# Altium project Center Console.PrjPcb (part 2 of 2)

## Sheet Center Console - Raspberry Pi Interface.SchDoc: Center Console - Raspberry Pi Interface
size B; Organization: Midnight Sun Solar Rayce Car Team; Address1: University of Waterloo; Address2: 200 University Ave W; Address3: Waterloo, ON, Canada; Address4: N2L 3E9; DocumentNumber: 4; SheetNumber: 4; SheetTotal: 4; Website: www.uwmidsun.com; ProjectName: ProjectName
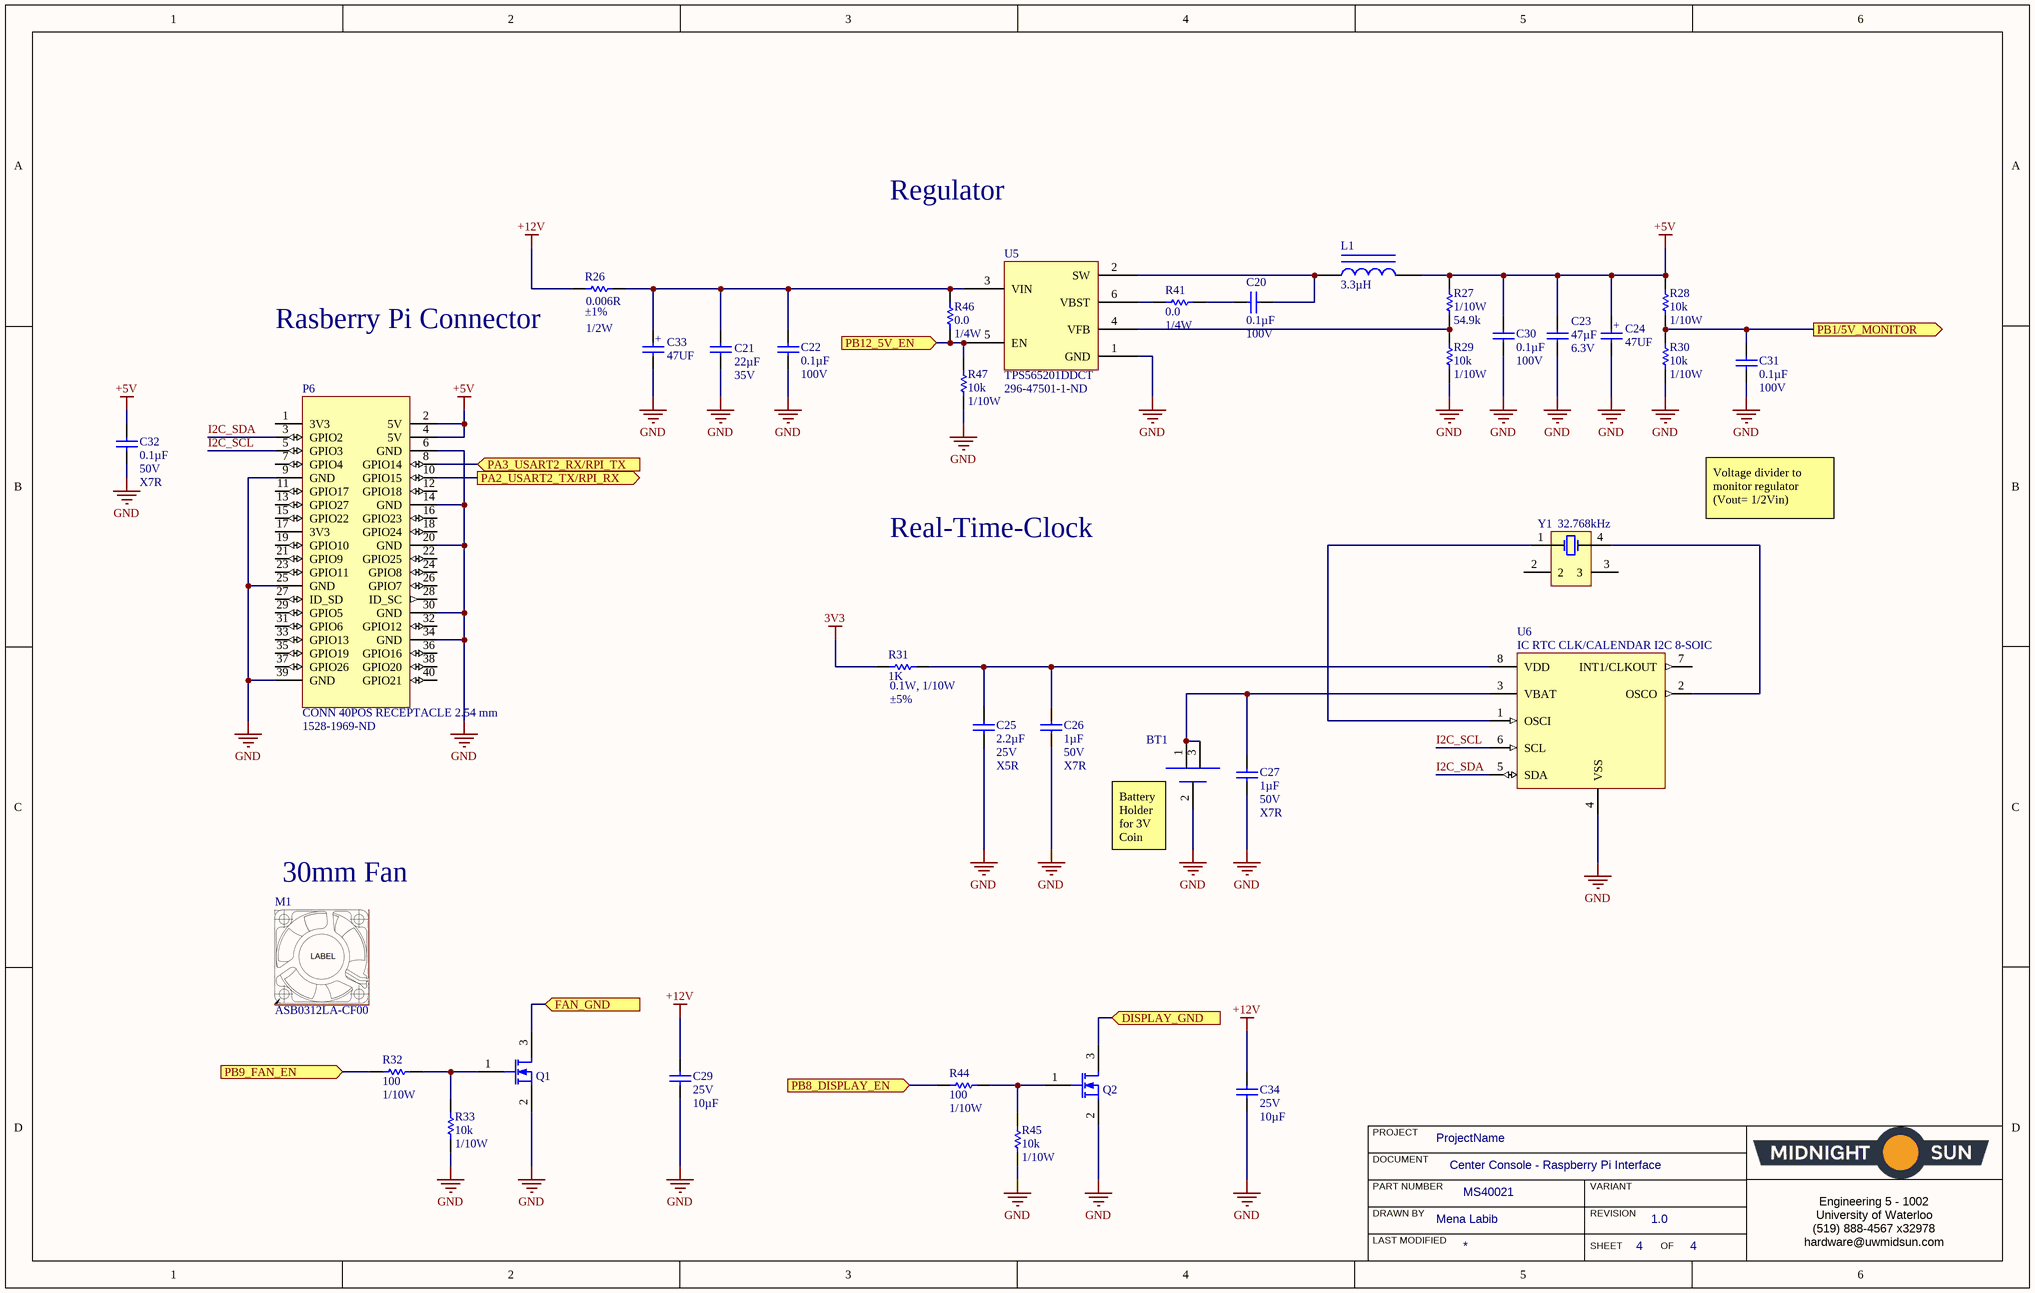
[diagram p3: Center Console - Raspberry Pi Interface.SchDoc]

### Parts
BT1  HOLDER BATTERY COIN 12MM DIA  [HOLDER COIN CELL 1220 3V]  (value not drawn)
C20  Capacitance: 0.1µF  Voltage: 100V  [CAP, 0805]  (hidden comment: CAP CER 0.1UF 100V 10% X7R 0805)
C21  CAP CER 22UF 35V X5R 0805  [CAP, 0805]  (value not drawn)
C22  Capacitance: 0.1µF  Voltage: 100V  [CAP, 0805]  (hidden comment: CAP CER 0.1UF 100V 10% X7R 0805)
C23  CAP CER 47UF 6.3V X7R 1210  [1210]  (value not drawn)
C24  47UF  [CAP ALUM 6.3MM RADIAL SMD]
C25  Capacitance: 2.2µF  Voltage: 25V  Temperature Coefficient: X5R  [CAP, 0603]  (hidden comment: CAP CER 2.2UF 25V 10% X5R 0603)
C26  Capacitance: 1µF  Voltage: 50V  Temperature Coefficient: X7R  [CAP, 0603]  (hidden comment: CAP CER 1UF 50V 10% X7R 0603)
C27  Capacitance: 1µF  Voltage: 50V  Temperature Coefficient: X7R  [CAP, 0603]  (hidden comment: CAP CER 1UF 50V 10% X7R 0603)
C29  Voltage - Rated: 25V  Capacitance: 10µF  [CAP, 0805]  (hidden comment: CAP CER 10uF 25V 10% X5R 0805)
C30  Capacitance: 0.1µF  Voltage: 100V  [CAP, 0805]  (hidden comment: CAP CER 0.1UF 100V 10% X7R 0805)
C31  Capacitance: 0.1µF  Voltage: 100V  [CAP, 0805]  (hidden comment: CAP CER 0.1UF 100V 10% X7R 0805)
C32  Capacitance: 0.1µF  Voltage: 50V  Temperature Coefficient: X7R  [CAP, 0603]  (hidden comment: CAP CER 0.1UF 50V 10% X7R 0603)
C33  47UF  [CAP ALUM 6.3MM RADIAL SMD]
C34  Voltage - Rated: 25V  Capacitance: 10µF  [CAP, 0805]  (hidden comment: CAP CER 10uF 25V 10% X5R 0805)
L1  Inductance: 3.3µH  [IND 3.3UH 5.2A 20 MOHM SMD VLP8040]  (hidden comment: IND 3.3uH 5.2A 20MOHM SMD)
M1  Manufacturer Part Number: ASB0312LA-CF00  [FAN AXIAL 30x10MM 12VDC]  (hidden comment: FAN AXIAL 30x10MM 12VDC)
P6  CONN 40POS RECEPTACLE 2.54 mm  Supplier Part Number 1: 1528-1969-ND  [CONN 40POS RECEPTACLE 2.54 MM]
Q1  MOSFET N-CH 30V 6.2A 0.9W SOT-23  [MOSFET N-CH 30V 6.2A 0.9W SOT-23]  (value not drawn)
Q2  MOSFET N-CH 30V 6.2A 0.9W SOT-23  [MOSFET N-CH 30V 6.2A 0.9W SOT-23]  (value not drawn)
R26  Tolerance: ±1%  Resistance (Ohms): 0.006R  Power (Watts): 1/2W  [RES 1206]  (hidden comment: RES 0.006 OHM 1% 1/2W 1206)
R27  Power (Watts): 1/10W  Resistance (Ohms): 54.9k  [RES, 0603]  (hidden comment: RES 54.9K OHM 1% 1/10W 0603)
R28  Resistance: 10k  Power: 1/10W  [RES, 0603]  (hidden comment: RES 10K OHM 1% 1/10W 0603)
R29  Resistance: 10k  Power: 1/10W  [RES, 0603]  (hidden comment: RES 10K OHM 1% 1/10W 0603)
R30  Resistance: 10k  Power: 1/10W  [RES, 0603]  (hidden comment: RES 10K OHM 1% 1/10W 0603)
R31  1K  Tolerance: ±5%  Power (Watts): 0.1W, 1/10W  [RES, 0603]
R32  Resistance: 100  Power: 1/10W  [RES, 0603]  (hidden comment: RES 100 OHM 1% 1/10W 0603)
R33  Resistance: 10k  Power: 1/10W  [RES, 0603]  (hidden comment: RES 10K OHM 1% 1/10W 0603)
R41  Resistance: 0.0  Power (Watts): 1/4W  [RES, 0603]  (hidden comment: RES 0.0 OHM 1/4W 0603)
R44  Resistance: 100  Power: 1/10W  [RES, 0603]  (hidden comment: RES 100 OHM 1% 1/10W 0603)
R45  Resistance: 10k  Power: 1/10W  [RES, 0603]  (hidden comment: RES 10K OHM 1% 1/10W 0603)
R46  Resistance: 0.0  Power (Watts): 1/4W  [RES, 0603]  (hidden comment: RES 0.0 OHM 1/4W 0603)
R47  Resistance: 10k  Power: 1/10W  [RES, 0603]  (hidden comment: RES 10K OHM 1% 1/10W 0603)
U5  Manufacturer Part Number: TPS565201DDCT  Supplier Part Number 1: 296-47501-1-ND  [IC REG BUCK 4.5V TO 17V, 5A]  (hidden comment: IC REG BUCK 4.5V TO 17V, 5A, SYNCHRONOUS STE)
U6  IC RTC CLK/CALENDAR I2C 8-SOIC  [SOIC8]
Y1  Frequency: 32.768kHz  [4-SOJ]  (hidden comment: CRYSTAL 32.7680KHZ 12.5PF SMD)

### Ports
DISPLAY_GND (in), FAN_GND (in), PA2_USART2_TX/RPI_RX (out), PA3_USART2_RX/RPI_TX (in), PB1/5V_MONITOR (out), PB8_DISPLAY_EN (in), PB9_FAN_EN (in), PB12_5V_EN (in)

### Nets
3V3: R31.1
+5V: C23.1 C24.1 C30.1 C32.1 L1.2 P6.2(5V) P6.4(5V) R27.1 R28.1
+12V: C29.1 C34.1 R26.1
GND: BT1.2(negative) C21.2 C22.2 C23.2 C24.2 C25.2 C26.2 C27.2 C29.2 C30.2 C31.2 C32.2 C33.2 C34.2 P6.6(GND) P6.9(GND) P6.14(GND) P6.20(GND) P6.25(GND) P6.30(GND) P6.34(GND) P6.39(GND) Q1.2(S) Q2.2(S) R29.2 R30.2 R33.2 R45.2 R47.2 U5.1(GND) U6.4(VSS)
DISPLAY_GND: Q2.3(D) ; port DISPLAY_GND
FAN_GND: Q1.3(D) ; port FAN_GND
I2C_SCL: P6.5(GPIO3) U6.6(SCL)  [project net I2C_SCL_4]
I2C_SDA: P6.3(GPIO2) U6.5(SDA)  [project net I2C_SDA_4]
PA2_RPI_USART2_TX: P6.10(GPIO15) ; port PA2_USART2_TX/RPI_RX
PA3_RPI_USART2_RX: P6.8(GPIO14) ; port PA3_USART2_RX/RPI_TX
PB1/5V_MONITOR: C31.1 R28.2 R30.1 ; port PB1/5V_MONITOR
PB8/DISPLAY_EN: R44.1 ; port PB8_DISPLAY_EN
PB9_FAN_EN: R32.1 ; port PB9_FAN_EN
PB12_5V_EN: R46.2 R47.1 U5.5(EN) ; port PB12_5V_EN
NetBT1_1: BT1.1(positive_1) BT1.3(positive_2) C27.1 U6.3(VBAT)
NetC20_1: C20.1 R41.2
NetC20_2: C20.2 L1.1 U5.2(SW)
NetC21_1: C21.1 C22.1 C33.1 R26.2 R46.1 U5.3(VIN)
NetC25_1: C25.1 C26.1 R31.2 U6.8(VDD)
NetQ1_1: Q1.1(G) R32.2 R33.1
NetQ2_1: Q2.1(G) R44.2 R45.1
NetR27_2: R27.2 R29.1 U5.4(VFB)
NetR41_1: R41.1 U5.6(VBST)
NetU6_1: U6.1(OSCI) Y1.1
NetU6_2: U6.2(OSCO) Y1.4

Not connected (* = marked no-connect by the designer): P6 1(3V3) 7(GPIO4) 11(GPIO17) 12(GPIO18) 13(GPIO27) 15(GPIO22) 16(GPIO23) 17(3V3) 18(GPIO24) 19(GPIO10) 21(GPIO9) 22(GPIO25) 23(GPIO11) 24(GPIO8) 26(GPIO7) 27(ID_SD) 28(ID_SC) 29(GPIO5) 31(GPIO6) 32(GPIO12) 33(GPIO13) 35(GPIO19) 36(GPIO16) 37(GPIO26) 38(GPIO20) 40(GPIO21); U6 7(INT1/CLKOUT); Y1 2 3

### Notes on the sheet
- Regulator
- (near R26) Rasberry Pi Connector
- Real-Time-Clock
- Voltage divider to monitor regulator (Vout= 1/2Vin)
- (near M1) 30mm Fan
- (near BT1) Battery Holder for 3V Coin Cell
- PROJECT
- DOCUMENT
- DRAWN BY
- LAST MODIFIED
- PART NUMBER
- REVISION
- SHEET
- VARIANT
- OF
- Engineering 5 - 1002
  University of Waterloo
  (519) 888-4567 x32978
  hardware@uwmidsun.com
- (in symbol CAP ALUM 47UF 20% 35V SMD) +
- (in symbol CAP CER 22UF 35V X5R 0805) 22µF
- (in symbol CAP CER 47UF 6.3V X7R 1210) 47µF

### Library data of the parts
BT1 = HOLDER BATTERY COIN 12MM DIA: Coin cell holder smd; Manufacturer: Keystone Electronics; Manufacturer Part Number: 3000; Body Material: Bronze; Number of Batteries: 1; Supplier 1: Digi-Key; Stock 1: 17093; Pricing 1: 1=0.58, 10=0.545, 50=0.4356, 100=0.4175, 250=0.38116, 500=0.363, 1000=0.30495, 2500=0.27225, 5000=0.26318 (USD); Mount: Surface Mount,PCB; Contact Material: Bronze,Nickel; Material: Bronze; Contact Plating: Nickel; Package Quantity: 100; Packaging: Bulk; Termination: SMD/SMT; Number of Cells: 1; Diameter: 12mm; Height: 3.17mm; REACH SVHC: No SVHC; Lead Free: Lead Free; ComponentLink1URL: https://datasheet.ciiva.com/3/3000-3953.pdf; ComponentLink1Description: https://datasheet.ciiva.com/3/3000-3953.pdf; ComponentLink2URL: https://datasheet.ciiva.com/11714/0900766b8002ef78-11714721.pdf; ComponentLink2Description: https://datasheet.ciiva.com/11714/0900766b8002ef78-11714721.pdf; ComponentLink3URL: https://datasheet.ciiva.com/20221/18-3570e-20221596.pdf; ComponentLink3Description: https://datasheet.ciiva.com/20221/18-3570e-20221596.pdf; ComponentLink4URL: https://datasheet.ciiva.com/1391/1718262-1391630.pdf; ComponentLink4Description: https://datasheet.ciiva.com/1391/1718262-1391630.pdf; Supplier Part Number 1: 36-3000-ND
C20 C22 C30 C31 = CAP CER 0.1UF 100V 10% X7R 0805: 0.1µF ±10% 100V Ceramic Capacitor X7R 0805 (2012 Metric); Manufacturer 1: Murata Electronics North America; Manufacturer Part Number 1: GCM21BR72A104KA37L; Supplier 1: Digi-Key; Supplier Part Number 1: 490-4789-1-ND; Packaging: Cut Tape (CT); Part Status: Active; Operating Temperature: -55°C ~ 125°C; Ratings: AEC-Q200; Mounting Type: Surface Mount, MLCC; Package / Case: 0805 (2012 Metric); Size / Dimension: 0.079" L x 0.049" W (2.00mm x 1.25mm); Height - Seated (Max): -; Thickness (Max): 0.055" (1.40mm); Lead Spacing: -; Lead Style: -; ComponentLink1URL: http://www.murata.com/~/media/webrenewal/support/library/catalog/products/capacitor/mlcc/c03e.ashx; ComponentLink1Description: http://www.murata.com/~/media/webrenewal/support/library/catalog/products/capacitor/mlcc/c03e.ashx; Tolerance: ±10%; Temperature Coefficient: X7R
C21 = CAP CER 22UF 35V X5R 0805: 22µF ±20% 35V Ceramic Capacitor X5R 0805 (2012 Metric); Manufacturer: TDK; Manufacturer Part Number: C2012X5R1V226M125AC; Supplier 1: Digi-Key; RoHS: Yes; Stock 1: 30; Pricing 1: 1 = 1.29000, 10 = 0.98100, 100 = 0.70190, 500 = 0.54338, 1000 = 0.46791 (USD); Mount: Surface Mount; Case/Package: 0805; Weight: 0.000194oz; Case Code (Metric): 2012; Case Code (Imperial): 0805; Dielectric Material: Ceramic; Min Operating Temperature: -55°C; Max Operating Temperature: 85°C; Package Quantity: 2000; Packaging: Tape and Reel; Capacitance: 22uF; Tolerance: 20%; Voltage Rating: 35V; Dielectric: X5R; Termination: SMD/SMT; Voltage Rating (DC): 35V; Length: 0.079inch; Height: 1.25mm; Width: 0.049inch; Thickness: 0.057inch; REACH SVHC: No SVHC; Lead Free: Lead Free; ComponentLink1URL: https://product.tdk.com/info/en/catalog/spec/mlccspec_commercial_general_midvoltage_en.pdf; ComponentLink1Description: https://product.tdk.com/info/en/catalog/spec/mlccspec_commercial_general_midvoltage_en.pdf; Supplier Part Number 1: 445-14428-1-ND
C23 = CAP CER 47UF 6.3V X7R 1210: 47µF ±10% 6.3V Ceramic Capacitor X7R 1210 (3225 Metric); Manufacturer: Murata; Manufacturer Part Number: GCJ32ER70J476KE01L; Supplier 1: Digi-Key; RoHS: Yes; Stock 1: 191399; Pricing 1: 1 = 1.53000, 10 = 1.21200, 100 = 0.90890, 500 = 0.68670 (USD); Mount: Surface Mount; Case/Package: 1210; Weight: 0.00388oz; Case Code (Metric): 3225; Case Code (Imperial): 1210; Min Operating Temperature: -55°C; Max Operating Temperature: 125°C; Capacitance: 47uF; Packaging: Tape and Reel; Voltage Rating: 6.3V; Tolerance: 10%; Dielectric: X7R; Termination: SMD/SMT; Voltage Rating (DC): 6.3V; Package Quantity: 1000; Features: Soft Termination; Length: 0.126inch; Height: 2.5mm; Width: 0.098inch; Thickness: 0.11inch; Ratings: AEC-Q200; Lead Free: Lead Free; Supplier Part Number 1: 490-10559-1-ND
C24 C33 = CAP ALUM 47UF 20% 35V SMD: 47µF 35V Aluminum Electrolytic Capacitors Radial, Can - SMD 1000 Hrs @ 85°C; Manufacturer: Panasonic; Manufacturer Part Number: EEE-1VA470WP; Tolerance: 20%; Ripple Current: 70mA; Life (Hours): 1000Hour; Supplier 1: Digi-Key; Stock 1: 2820; Pricing 1: 1=0.38, 10=0.263, 100=0.1579, 500=0.11846 (USD); Mount: Surface Mount,PCB; Case/Package: Radial; Contact Plating: Tin; Min Operating Temperature: -40°C; Max Operating Temperature: 85°C; Capacitance: 47uF; Voltage Rating (DC): 35V; Voltage Rating: 35V; Packaging: Tape and Reel; Package Quantity: 1; Ripple Current (AC): 70mA; Termination: SMD/SMT; Diameter: 6.3mm; Length: 5.5mm; Height: 5.4mm; Height - Seated (Max): 0.213inch; Radiation Hardening: No; REACH SVHC: Unknown; Lead Free: Lead Free; ComponentLink1URL: https://datasheet.ciiva.com/2983/aba0000ce2-2983926.pdf; ComponentLink1Description: https://datasheet.ciiva.com/2983/aba0000ce2-2983926.pdf; ComponentLink2URL: https://datasheet.ciiva.com/2983/aba0000ce2-2983927.pdf; ComponentLink2Description: https://datasheet.ciiva.com/2983/aba0000ce2-2983927.pdf; ComponentLink3URL: https://datasheet.ciiva.com/14598/70255710-14598937.pdf; ComponentLink3Description: https://datasheet.ciiva.com/14598/70255710-14598937.pdf; ComponentLink4URL: https://datasheet.ciiva.com/15165/getdatasheetpartid-86239-15165868.pdf; ComponentLink4Description: https://datasheet.ciiva.com/15165/getdatasheetpartid-86239-15165868.pdf; ComponentLink5URL: https://datasheet.ciiva.com/16507/aba0000ce2-16507965.pdf; ComponentLink5Description: https://datasheet.ciiva.com/16507/aba0000ce2-16507965.pdf; ComponentLink6URL: https://datasheet.ciiva.com/30206/11aba0000ce2-30206253.pdf; ComponentLink6Description: https://datasheet.ciiva.com/30206/11aba0000ce2-30206253.pdf; Supplier Part Number 1: PCE3961CT-ND
C25 = CAP CER 2.2UF 25V 10% X5R 0603: 2.2µF ±10% 25V Ceramic Capacitor X5R 0603 (1608 Metric); Manufacturer 1: Murata Electronics North America; Manufacturer Part Number 1: GRM188R61E225KA12D; Supplier 1: Digi-Key; Supplier Part Number 1: 490-10731-1-ND; Packaging: Cut Tape (CT); Part Status: Active; Operating Temperature: -55°C ~ 85°C; Ratings: -; Mounting Type: Surface Mount, MLCC; Package / Case: 0603 (1608 Metric); Size / Dimension: 0.063" L x 0.031" W (1.60mm x 0.80mm); Height - Seated (Max): -; Thickness (Max): 0.035" (0.90mm); Lead Spacing: -; Lead Style: -; ComponentLink1URL: http://www.murata.com/~/media/webrenewal/support/library/catalog/products/capacitor/mlcc/c02e.ashx; ComponentLink1Description: http://www.murata.com/~/media/webrenewal/support/library/catalog/products/capacitor/mlcc/c02e.ashx; Tolerance: ±10%
C26 C27 = CAP CER 1UF 50V 10% X7R 0603: 1µF ±10% 50V Ceramic Capacitor X7R 0603 (1608 Metric); Manufacturer 1: Taiyo Yuden; Manufacturer Part Number 1: UMK107AB7105KA-T; Supplier 1: Digi-Key; Supplier Part Number 1: 587-3247-1-ND; Packaging: Cut Tape (CT); Part Status: Active; Operating Temperature: -55°C ~ 125°C; Ratings: -; Mounting Type: Surface Mount, MLCC; Package / Case: 0603 (1608 Metric); Size / Dimension: 0.063" L x 0.031" W (1.60mm x 0.80mm); Height - Seated (Max): -; Thickness (Max): 0.037" (0.95mm); Lead Spacing: -; Lead Style: -; ComponentLink1URL: http://www.yuden.co.jp/productdata/catalog/en/mlcc_all_e.pdf; ComponentLink1Description: http://www.yuden.co.jp/productdata/catalog/en/mlcc_all_e.pdf; Tolerance: ±10%
C29 C34 = CAP CER 10uF 25V 10% X5R 0805: 10µF ±10% 25V Ceramic Capacitor X5R 0805 (2012 Metric); Manufacturer: Murata Electronics North America; Manufacturer Part Number: GRM21BR61E106KA73L; Supplier 1: Digi-Key; RoHS: RoHS Compliant; Category: Capacitors; Stock 1: 1695157; Packaging: Cut Tape (CT); Part Status: Active; Tolerance: ±10%; Temperature Coefficient: X5R; Operating Temperature: -55°C ~ 85°C; Features: -; Ratings: -; Applications: General Purpose; Mounting Type: Surface Mount, MLCC; Package / Case: 0805 (2012 Metric); Size / Dimension: 0.079" L x 0.049" W (2.00mm x 1.25mm); Height - Seated (Max): -; Thickness (Max): 0.053" (1.35mm); Lead Spacing: -; Lead Style: -; ComponentLink1URL: http://search.murata.co.jp/Ceramy/image/img/A01X/G101/ENG/GRM21BR61E106KA73-01.pdf; ComponentLink1Description: http://search.murata.co.jp/Ceramy/image/img/A01X/G101/ENG/GRM21BR61E106KA73-01.pdf; Supplier Part Number 1: 490-5523-1-ND; Pricing 1: 1=0.3, 10=0.214, 100=0.1008, 500=0.07068, 1000=0.05851 (CAD)
C32 = CAP CER 0.1UF 50V 10% X7R 0603: 0.10µF ±10% 50V Ceramic Capacitor X7R 0603 (1608 Metric); Manufacturer 1: AVX Corporation; Manufacturer Part Number 1: 06035C104KAT2A; Supplier 1: Digi-Key; Supplier Part Number 1: 478-5052-1-ND; Packaging: Cut Tape (CT); Part Status: Active; Operating Temperature: -55°C ~ 125°C; Ratings: -; Mounting Type: Surface Mount, MLCC; Package / Case: 0603 (1608 Metric); Size / Dimension: 0.063" L x 0.032" W (1.60mm x 0.81mm); Height - Seated (Max): -; Thickness (Max): 0.035" (0.90mm); Lead Spacing: -; Lead Style: -; ComponentLink1URL: http://datasheets.avx.com/X7RDielectric.pdf; ComponentLink1Description: http://datasheets.avx.com/X7RDielectric.pdf; Tolerance: ±10%
L1 = IND 3.3uH 5.2A 20MOHM SMD: 3.3µH Shielded Wirewound Inductor 5.2A 20 mOhm Max Nonstandard; Manufacturer: TDK Corporation; Manufacturer Part Number: VLS201612CX-3R3M; Material - Core: Ferrite; Tolerance: ±20%; Current Rating: 1.37A; Current - Saturation: 1.04A; DC Resistance (DCR): 170 mOhm Max; Frequency - Test: 1MHz; Inductance Tolerance: 30%; Test Frequency: 100kHz; RoHS: RoHS Compliant; Category: Inductors, Coils, Chokes; Packaging: Cut Tape (CT); Type: Wirewound; Shielding: Shielded; Q @ Freq: -; Frequency - Self Resonant: -; Operating Temperature: -40°C ~ 105°C; Mounting Type: Surface Mount; Package / Case: Nonstandard; Size / Dimension: 0.079" L x 0.063" W (2.00mm x 1.60mm); Height - Seated (Max): 0.047" (1.20mm); Supplier Device Package: 2016; ComponentLink1URL: http://product.tdk.com/en/catalog/datasheets/inductor_commercial_power_vls-cx_en.pdf; ComponentLink1Description: http://product.tdk.com/en/catalog/datasheets/inductor_commercial_power_vls-cx_en.pdf; Supplier 1: Digi-Key; Stock 1: 8114; Pricing 1: 1 = 0.60000, 10 = 0.52700, 100 = 0.37660, 500 = 0.31636 (USD); Mount: Surface Mount; Case/Package: Nonstandard; Core Material: Ferrite; Min Operating Temperature: -40°C; Max Operating Temperature: 105°C; Package Quantity: 1; Saturation Current: 5.2A; Max DC Current: 5.2A; Termination: SMD/SMT; Composition: Wirewound; RMS Current (Irms): 5.2A; Military Standard: Not; Length: 0.315inch; Height: 4mm; Width: 8mm; Depth: 8.7mm; REACH SVHC: No SVHC; Lead Free: Lead Free; ComponentLink2URL: http://www.mouser.com/ds/2/400/nductor_commercial_power_vlp8040_en-952627.pdf; ComponentLink2Description: http://www.mouser.com/ds/2/400/nductor_commercial_power_vlp8040_en-952627.pdf; Supplier Part Number 1: 445-6581-1-ND
M1 = FAN AXIAL 30x10MM 12VDC: FAN AXIAL 30X10MM 12VDC WIRE; Manufacturer: Delta Design; Current Rating: 50mA; Airflow: 3.2CFM; Noise: 21dBA; Max Power Dissipation: 600mW; RPM: 8000RPM; Bearing Type: Sleeve; Supplier 1: Digi-Key; Supplier Part Number 1: 603-1728-ND; RoHS: Yes; Stock 1: 2468; Case/Package: Axial; Weight: 0.016lb; Package Quantity: 1440; Termination: 3 Wire Leads; Width: 10mm; ComponentLink1URL: http://www.delta-fan.com/Download/Spec/ASB0312LA-CF00.pdf; ComponentLink1Description: http://www.delta-fan.com/Download/Spec/ASB0312LA-CF00.pdf
P6 = CONN 40POS RECEPTACLE 2.54 mm: GPIO HEADER FOR RASPBERRYPI A+/B; Manufacturer: Adafruit Industries; Manufacturer Part Number: 1992; Supplier 1: Digi-Key; Stock 1: 175; Pricing 1: 1=2.95 (USD); ComponentLink1Description: gpio header raspberry pi; ComponentLink1URL: https://www.digikey.ca/product-detail/en/adafruit-industries-llc/1992/1528-1969-ND/6827092
Q1 Q2 = MOSFET N-CH 30V 6.2A 0.9W SOT-23: N-Channel 30V 6.2A (Ta) 900mW (Ta) Surface Mount SOT-23; Manufacturer: Diodes; Manufacturer Part Number: DMN3023L-7; Rds On Max: 25mR; Input Capacitance: 873pF; Supplier 1: Digi-Key; Stock 1: 38246; Pricing 1: 1=0.47, 10=0.368, 100=0.2529, 500=0.1734, 1000=0.1301 (USD); Mount: Surface Mount; Case/Package: TO-236-3; Min Operating Temperature: -55°C; Max Operating Temperature: 150°C; Packaging: Tape and Reel; Drain to Source Voltage (Vdss): 30V; Continuous Drain Current (ID): 6.2A; Max Power Dissipation: 900mW; ComponentLink1URL: https://www.diodes.com/assets/Datasheets/DMN3023L.pdf; ComponentLink1Description: https://www.diodes.com/assets/Datasheets/DMN3023L.pdf; ComponentLink2URL: http://www.mouser.com/ds/2/115/DMN3023L-959533.pdf; ComponentLink2Description: http://www.mouser.com/ds/2/115/DMN3023L-959533.pdf; Supplier Part Number 1: DMN3023L-7DICT-ND
R26 = RES 0.006 OHM 1% 1/2W 1206: 0.006 Ohm ±1% 0.5W, 1/2W Chip Resistor 1206 (3216 Metric) Automotive AEC-Q200, Current Sense, Moisture Resistant Metal Element; Manufacturer: Panasonic Electronic Components; Manufacturer Part Number: ERJ-MP2KF6M0U; Temperature Coefficient: ±75ppm/°C; Supplier 1: Digi-Key; Supplier Part Number 1: P19333CT-ND; Packaging: Cut Tape (CT); Part Status: Active; Composition: Metal Element; Operating Temperature: -65°C ~ 170°C; Package / Case: 1206 (3216 Metric); Supplier Device Package: 1206; Size / Dimension: 0.125" L x 0.063" W (3.18mm x 1.60mm); Height - Seated (Max): 0.035" (0.89mm); Failure Rate: -; ComponentLink1URL: http://industrial.panasonic.com/cdbs/www-data/pdf/RDN0000/AOA0000C263.pdf; ComponentLink1Description: http://industrial.panasonic.com/cdbs/www-data/pdf/RDN0000/AOA0000C263.pdf; RoHS: RoHS Compliant; Category: Resistors; Features: Automotive AEC-Q200, Current Sense, Moisture Resistant
R27 = RES 54.9K OHM 1% 1/10W 0603: 54.9k Ohm ±1% 0.1W, 1/10W Chip Resistor 0603 (1608 Metric) Automotive AEC-Q200 Thick Film; Manufacturer: Panasonic Electronic Components; Manufacturer Part Number: ERJ-3EKF5492V; Temperature Coefficient: ±100ppm/°C; Supplier 1: Digi-Key; RoHS: RoHS Compliant; Category: Resistors; Stock 1: 74038; Pricing 1: 1=0.16, 10=0.031, 100=0.0127, 1000=0.00567, 2500=0.00492 (CAD); Packaging: Cut Tape (CT); Part Status: Active; Composition: Thick Film; Features: Automotive AEC-Q200; Operating Temperature: -55°C ~ 155°C; Package / Case: 0603 (1608 Metric); Supplier Device Package: 0603; Size / Dimension: 0.063" L x 0.031" W (1.60mm x 0.80mm); Height - Seated (Max): 0.022" (0.55mm); Failure Rate: -; ComponentLink1URL: https://industrial.panasonic.com/cdbs/www-data/pdf/RDA0000/AOA0000C298.pdf; ComponentLink1Description: https://industrial.panasonic.com/cdbs/www-data/pdf/RDA0000/AOA0000C298.pdf; Supplier Part Number 1: P54.9KHCT-ND; Tolerance: ±1%
R28-R30 R33 R45 R47 = RES 10K OHM 1% 1/10W 0603: RES SMD 10K OHM 1% 1/10W 0603; Manufacturer 1: Yageo; Manufacturer Part Number 1: RC0603FR-0710KL; Temperature Coefficient: ±100ppm/°C; Supplier 1: Digi-Key; Supplier Part Number 1: 311-10.0KHRCT-ND; Packaging: Cut Tape (CT); Part Status: Active; Composition: Thick Film; Operating Temperature: -55°C ~ 155°C; Package / Case: 0603 (1608 Metric); Supplier Device Package: 0603; Size / Dimension: 0.063" L x 0.031" W (1.60mm x 0.80mm); Height - Seated (Max): 0.022" (0.55mm); Failure Rate: -; ComponentLink1URL: http://www.yageo.com/documents/recent/PYu-RC_Group_51_RoHS_L_7.pdf; ComponentLink1Description: http://www.yageo.com/documents/recent/PYu-RC_Group_51_RoHS_L_7.pdf; Tolerance: ±1%
R31 = RES 1K OHM 5% 1/10W 0603: 1k Ohm ±5% 0.1W, 1/10W Chip Resistor 0603 (1608 Metric); Manufacturer: Yageo; Manufacturer Part Number: RC0603JR-071KL; Temperature Coefficient: ±100ppm/°C; Supplier 1: Digi-Key; Supplier Part Number 1: 311-1.0KGRCT-ND; RoHS: RoHS Compliant; Category: Resistors; Stock 1: 4415240; Pricing 1: 1=0.15, 10=0.017, 100=0.0071, 1000=0.0032, 2500=0.00278 (CAD); Packaging: Cut Tape (CT); Part Status: Active; Resistance (Ohms): 1k; Composition: Thick Film; Features: Moisture Resistant; Operating Temperature: -55°C ~ 155°C; Package / Case: 0603 (1608 Metric); Supplier Device Package: 0603; Size / Dimension: 0.063" L x 0.031" W (1.60mm x 0.80mm); Height - Seated (Max): 0.022" (0.55mm); Failure Rate: -; ComponentLink1URL: http://www.yageo.com/documents/recent/PYu-RC_Group_51_RoHS_L_7.pdf; ComponentLink1Description: http://www.yageo.com/documents/recent/PYu-RC_Group_51_RoHS_L_7.pdf
R32 R44 = RES 100 OHM 1% 1/10W 0603: 100 Ohm ±1% 0.1W, 1/10W Chip Resistor 0603 (1608 Metric) Moisture Resistant Thick Film; Manufacturer 1: Yageo; Manufacturer Part Number 1: RC0603FR-07100RL; Temperature Coefficient: ±100ppm/°C; Supplier 1: Digi-Key; Supplier Part Number 1: 311-100HRCT-ND; Packaging: Cut Tape (CT); Part Status: Active; Composition: Thick Film; Operating Temperature: -55°C ~ 155°C; Package / Case: 0603 (1608 Metric); Supplier Device Package: 0603; Size / Dimension: 0.063" L x 0.031" W (1.60mm x 0.80mm); Height - Seated (Max): 0.022" (0.55mm); Failure Rate: -; ComponentLink1URL: http://www.yageo.com/documents/recent/PYu-RC_Group_51_RoHS_L_7.pdf; ComponentLink1Description: http://www.yageo.com/documents/recent/PYu-RC_Group_51_RoHS_L_7.pdf; Tolerance: ±1%
R41 R46 = RES 0.0 OHM 1/4W 0603: RES SMD 0.0 OHM JUMPER 1/4W 0603; Manufacturer 1: Vishay Dale; Manufacturer Part Number 1: CRCW06030000Z0EAHP; Supplier 1: Digi-Key; Supplier Part Number 1: 541-0.0SBCT-ND; Packaging: Cut Tape (CT); Part Status: Active; Composition: Thick Film; Operating Temperature: -55°C ~ 155°C; Package / Case: 0603 (1608 Metric); Supplier Device Package: 0603; Size / Dimension: 0.063" L x 0.033" W (1.60mm x 0.85mm); Height - Seated (Max): 0.022" (0.55mm); Failure Rate: -; ComponentLink1URL: http://www.vishay.com/docs/20043/crcwhpe3.pdf; ComponentLink1Description: http://www.vishay.com/docs/20043/crcwhpe3.pdf
U5 = IC REG BUCK 4.5V TO 17V, 5A, SYNCHRONOUS STE: Buck Switching Regulator IC Positive Adjustable 0.6V 1 Output 5A SOT-23-6 Thin, TSOT-23-6; Manufacturer: Texas Instruments; Supplier 1: Digi-Key; Stock 1: 2226; Pricing 1: 1 = 2.46000, 10 = 2.21100, 100 = 1.77710 (USD); Min Operating Temperature: -40°C; Max Operating Temperature: 125°C
U6 = IC RTC CLK/CALENDAR I2C 8-SOIC: Real Time Clock (RTC) IC Clock/Calendar I²C, 2-Wire Serial 8-SOIC (0.154", 3.90mm Width); Manufacturer: NXP Semiconductors; Manufacturer Part Number: PCF8523T/1,118; Min Supply Voltage: 1.2V; Max Supply Voltage: 5.5V; Time Format: HH:MM:SS; Supplier 1: Digi-Key; Stock 1: 18252; Pricing 1: 1=1.3, 10=1.16, 100=0.9045, 500=0.74718, 1000=0.58988 (USD); Mount: Surface Mount; Case/Package: SO; Number of Pins: 8; Contact Plating: Gold; Min Operating Temperature: -40°C; Max Operating Temperature: 85°C; Packaging: Tape and Reel; Interface: I2C; Package Quantity: 2500; Logic Function: Clock; Radiation Hardening: No; REACH SVHC: No SVHC; Lead Free: Lead Free; ComponentLink1URL: https://datasheet.ciiva.com/15152/getdatasheetpartid-445247-15152839.pdf; ComponentLink1Description: https://datasheet.ciiva.com/15152/getdatasheetpartid-445247-15152839.pdf; ComponentLink2URL: https://datasheet.ciiva.com/1238/pcf8523-1238780.pdf; ComponentLink2Description: https://datasheet.ciiva.com/1238/pcf8523-1238780.pdf; ComponentLink3URL: https://datasheet.ciiva.com/1238/pcf8523-1238781.pdf; ComponentLink3Description: https://datasheet.ciiva.com/1238/pcf8523-1238781.pdf; ComponentLink4URL: https://datasheet.ciiva.com/16286/pcf8523-16286477.pdf; ComponentLink4Description: https://datasheet.ciiva.com/16286/pcf8523-16286477.pdf; ComponentLink5URL: https://datasheet.ciiva.com/1238/pcf8523-1238782.pdf; ComponentLink5Description: https://datasheet.ciiva.com/1238/pcf8523-1238782.pdf; Supplier Part Number 1: 568-5306-1-ND
Y1 = CRYSTAL 32.7680KHZ 12.5PF SMD: 32.768kHz ±20ppm Crystal 12.5pF 50 kOhms 4-SOJ, 5.50mm pitch; Manufacturer: ECS International; Manufacturer Part Number: ECS-.327-12.5-17X-TR; ESR (Equivalent Series Resistance): 50kR; Supplier 1: Digi-Key; Stock 1: 67622; Pricing 1: 1=0.56, 10=0.468, 50=0.4208, 100=0.374, 500=0.3553, 1000=0.2992 (USD); Mount: Surface Mount; Min Operating Temperature: -40°C; Max Operating Temperature: 85°C; Package Quantity: 1; Frequency Tolerance: 20ppm; Load Capacitance: 12.5pF; Packaging: Tape and Reel; Tolerance: 20ppm; Termination: SMD/SMT; Length: 0.315inch; Height: 0.098inch; Width: 0.15inch; Lead Free: Lead Free; ComponentLink1URL: https://datasheet.ciiva.com/852/ecx-306x-852775.pdf; ComponentLink1Description: https://datasheet.ciiva.com/852/ecx-306x-852775.pdf; ComponentLink2URL: https://datasheet.ciiva.com/852/ecx-306x-852776.pdf; ComponentLink2Description: https://datasheet.ciiva.com/852/ecx-306x-852776.pdf; ComponentLink3URL: https://datasheet.ciiva.com/852/ecx-306x-852777.pdf; ComponentLink3Description: https://datasheet.ciiva.com/852/ecx-306x-852777.pdf; Supplier Part Number 1: XC1195CT-ND

## Nets that join several sheets
3V3: Center Console - Connectors (14 pins), Center Console - Buttons Interface (*.14 C1.1 C4.1 U2.5), Center Console - LED Interface (5 pins), Center Console - Raspberry Pi Interface (R31.1)
+5V: Center Console - Connectors (R2.1 TP3.TP), Center Console - Raspberry Pi Interface (9 pins)
+12V: Center Console - Connectors (9 pins), Center Console - LED Interface (C17.1 C18.1 U3.9), Center Console - Raspberry Pi Interface (C29.1 C34.1 R26.1)
GND: Center Console - Connectors (28 pins), Center Console - Buttons Interface (25 pins), Center Console - LED Interface (16 pins), Center Console - Raspberry Pi Interface (31 pins)
BPS_LED: Center Console - Connectors (R42.2), Center Console - LED Interface (U3.11)
DISPLAY_GND: Center Console - Connectors (P8.2), Center Console - Raspberry Pi Interface (Q2.3)
DRIVE_BTN: Center Console - Connectors (P3.13 R38.2), Center Console - Buttons Interface (C15.1 R16.1)
DRIVE_LED: Center Console - Connectors (P3.15), Center Console - LED Interface (U3.17)
DRL_BTN: Center Console - Connectors (P2.11 R36.2), Center Console - Buttons Interface (C13.1 R15.1)
DRL_LED: Center Console - Connectors (P2.5), Center Console - LED Interface (U3.14)
FAN_GND: Center Console - Connectors (P1.2), Center Console - Raspberry Pi Interface (Q1.3)
HAZARDS_BTN: Center Console - Connectors (P2.1 R35.2), Center Console - Buttons Interface (C7.1 R11.1)
HAZARDS_LED: Center Console - Connectors (P2.3), Center Console - LED Interface (U3.12)
LOW_BEAM_BTN: Center Console - Connectors (P2.7 R34.2), Center Console - Buttons Interface (C9.1 R12.1)
LOW_BEAM_LED: Center Console - Connectors (P2.9), Center Console - LED Interface (U3.13)
NEUTRAL_BTN: Center Console - Connectors (P3.9 R37.2), Center Console - Buttons Interface (C11.1 R13.1)
NEUTRAL_LED: Center Console - Connectors (P3.11), Center Console - LED Interface (U3.16)
PA0_LOW_BEAM: Center Console - Connectors (P5.25), Center Console - Buttons Interface (*.2 R9.1)
PA1_HAZARDS: Center Console - Connectors (P5.24), Center Console - Buttons Interface (*.4 R8.1)
PA2_RPI_USART2_TX: Center Console - Connectors (P5.23), Center Console - Raspberry Pi Interface (P6.10)
PA3_RPI_USART2_RX: Center Console - Connectors (P5.22), Center Console - Raspberry Pi Interface (P6.8)
PA4_DRL: Center Console - Connectors (P5.21), Center Console - Buttons Interface (*.6 R7.1)
PA5_DRIVE: Center Console - Connectors (P5.20), Center Console - Buttons Interface (*.8 R6.1)
PA6_NEUTRAL: Center Console - Connectors (P5.19), Center Console - Buttons Interface (*.10 R5.1)
PA7_REVERSE: Center Console - Connectors (P5.18), Center Console - Buttons Interface (*.12 R4.1)
PB0_POWER: Center Console - Connectors (P5.17), Center Console - Buttons Interface (R14.1 U2.4)
PB1/5V_MONITOR: Center Console - Connectors (P5.16), Center Console - Raspberry Pi Interface (C31.1 R28.2 R30.1)
PB8/DISPLAY_EN: Center Console - Connectors (P5.32), Center Console - Raspberry Pi Interface (R44.1)
PB9_FAN_EN: Center Console - Connectors (P5.31), Center Console - Raspberry Pi Interface (R32.1)
PB10_I2C2_SCL: Center Console - Connectors (P5.14 TP5.TP), Center Console - LED Interface (R18.2 U4.1)
PB11_I2C2_SDA: Center Console - Connectors (P5.13 TP4.TP), Center Console - LED Interface (R17.2 U4.2)
PB12_5V_EN: Center Console - Connectors (P5.11), Center Console - Raspberry Pi Interface (R46.2 R47.1 U5.5)
PWR_BTN: Center Console - Connectors (P3.1 R40.2), Center Console - Buttons Interface (C2.1 R3.1)
PWR_LED: Center Console - Connectors (P3.3), Center Console - LED Interface (U3.15)
REVERSE_BTN: Center Console - Connectors (P3.5 R39.2), Center Console - Buttons Interface (C5.1 R10.1)
REVERSE_LED: Center Console - Connectors (P3.7), Center Console - LED Interface (U3.18)